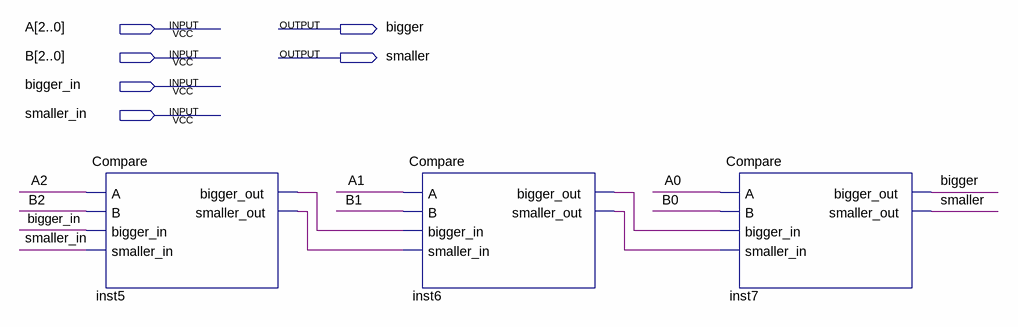
[diagram p0: schematic sheet]
// Quartus schematic Compare3.bdf as structural Verilog: 3 symbols, 6 pins
module Compare3 (
  input  [2:0] A,
  input  [2:0] B,
  input  bigger_in,
  input  smaller_in,
  output bigger,
  output smaller
);

  wire inst5_bigger_out, inst5_smaller_out, inst6_bigger_out, inst6_smaller_out;

  Compare inst5 (
    .A(A[2]), .B(B[2]), .bigger_in(bigger_in), .smaller_in(smaller_in), .bigger_out(inst5_bigger_out),
    .smaller_out(inst5_smaller_out));
  Compare inst6 (
    .A(A[1]), .B(B[1]), .bigger_in(inst5_bigger_out), .smaller_in(inst5_smaller_out),
    .bigger_out(inst6_bigger_out), .smaller_out(inst6_smaller_out));
  Compare inst7 (
    .A(A[0]), .B(B[0]), .bigger_in(inst6_bigger_out), .smaller_in(inst6_smaller_out), .bigger_out(bigger),
    .smaller_out(smaller));
endmodule
